# EAGLE design Rs232Iso-due (EAGLE 6.4)
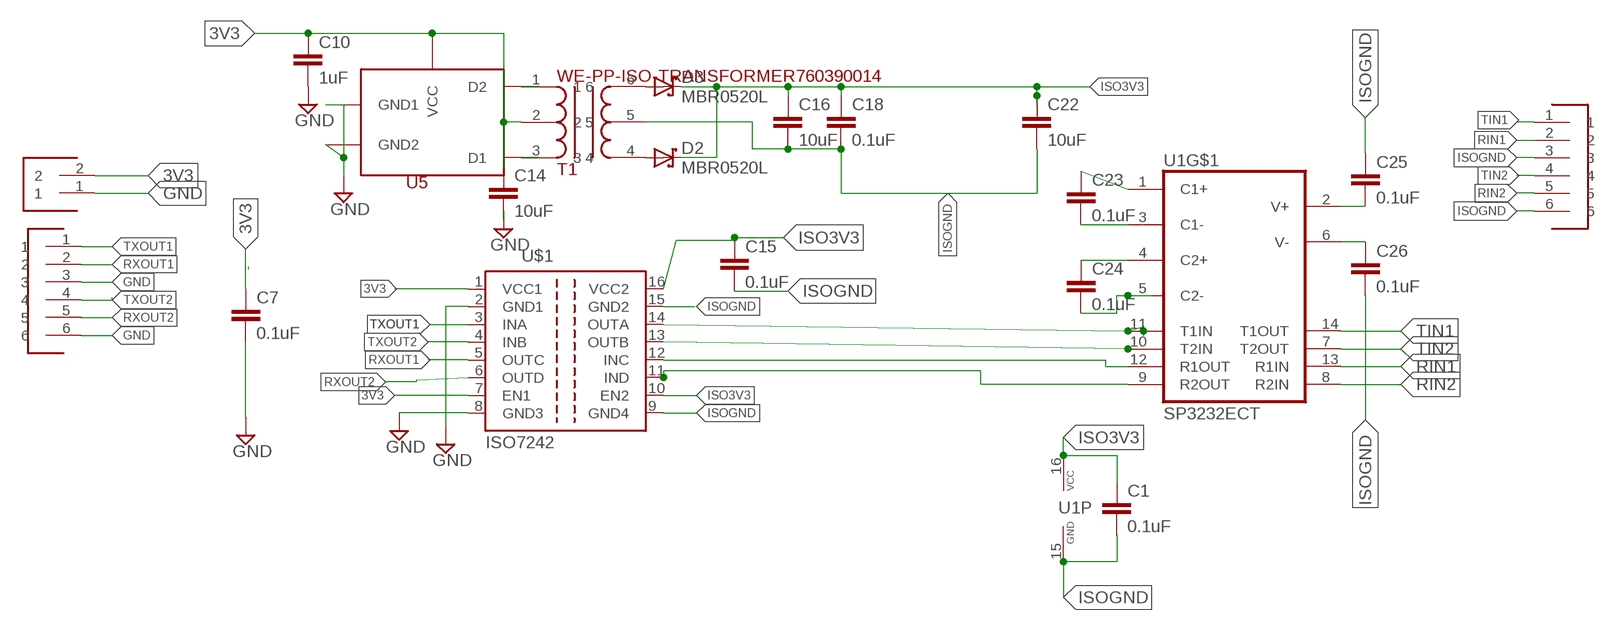
[diagram p0: schematic, sheet 1]

## Parts
C1  0.1uF  CAP0603  [0603]
C7  0.1uF  CAP0603  [0603]
C10  1uF  CAP0805  [0805]
C14  10uF  CAP0805  [0805]
C15  0.1uF  CAP0603  [0603]
C16  10uF  CAP0805  [0805]
C18  0.1uF  CAP0805  [0805]
C22  10uF  CAP0805  [0805]
C23  0.1uF  CAP0603  [0603]
C24  0.1uF  CAP0603  [0603]
C25  0.1uF  CAP0603  [0603]
C26  0.1uF  CAP0603  [0603]
D2  MBR0520L  [SOD123]
D3  MBR0520L  [SOD123]
J1  CON-2STD-2.54  [CON-2]
J2  CON-6  [CON-6]
J4  CON-6  [CON-6]
T1  WE-PP-ISO-TRANSFORMER760390014  [WE_TRANSFORMER]
U1  SP3232ECT  [SO16]
U5  SN6501DBVT  [SOT23-5L]
U$1  ISO7242  [SO-G16]

## Nets
3V3: C7.1 C10.1 C14.1 J1.2 T1.2 U5.2(VCC) U$1.1(VCC1) U$1.7(EN1)
GND: C7.2 C10.2 C14.2 J1.1 J4.3 J4.6 U5.4(GND1) U5.5(GND2) U$1.2(GND1) U$1.8(GND3)
ISO3V3: C1.1 C15.1 C16.1 C18.1 C22.1 D2.C D3.C U1.16(P:VCC) U$1.10(EN2) U$1.16(VCC2)
ISOGND: C1.2 C15.2 C16.2 C18.2 C22.2 C25.1 C26.2 J2.3 J2.6 T1.5 U1.15(P:GND) U$1.9(GND4) U$1.15(GND2)
N$1: D3.A T1.6
N$2: D2.A T1.4
N$4: T1.1 U5.3(D2)
N$5: T1.3 U5.1(D1)
N$6: U1.12(R1OUT) U$1.12(INC)
N$7: U1.10(T2IN) U$1.13(OUTB)
N$9: U1.11(T1IN) U$1.14(OUTA)
N$10: C23.2 U1.3(C1-)
N$11: U1.9(R2OUT) U$1.11(IND)
N$14: C24.1 U1.4(C2+)
N$18: C24.2 U1.5(C2-)
N$19: C23.1 U1.1(C1+)
RIN1: J2.2 U1.13(R1IN)
RIN2: J2.5 U1.8(R2IN)
RXOUT1: J4.2 U$1.5(OUTC)
RXOUT2: J4.5 U$1.6(OUTD)
TIN1: J2.1 U1.14(T1OUT)
TIN2: J2.4 U1.7(T2OUT)
TXOUT1: J4.1 U$1.3(INA)
TXOUT2: J4.4 U$1.4(INB)
V+: C25.2 U1.2(V+)
V-: C26.1 U1.6(V-)

## Library data of the parts
C1 C7 C10 C14-C16 C18 C22-C26 = __bo_caps:CAP
D2 D3 = __my:MBR0520L
J1 = __my:CON-2
J2 J4 = __my:CON-6
T1 = __my:WE-PP-ISO-TRANSFORMER
U1 = __my:SP3232
U5 = __my:SN6501DBVT
U$1 = __my:ISO7242

## Board
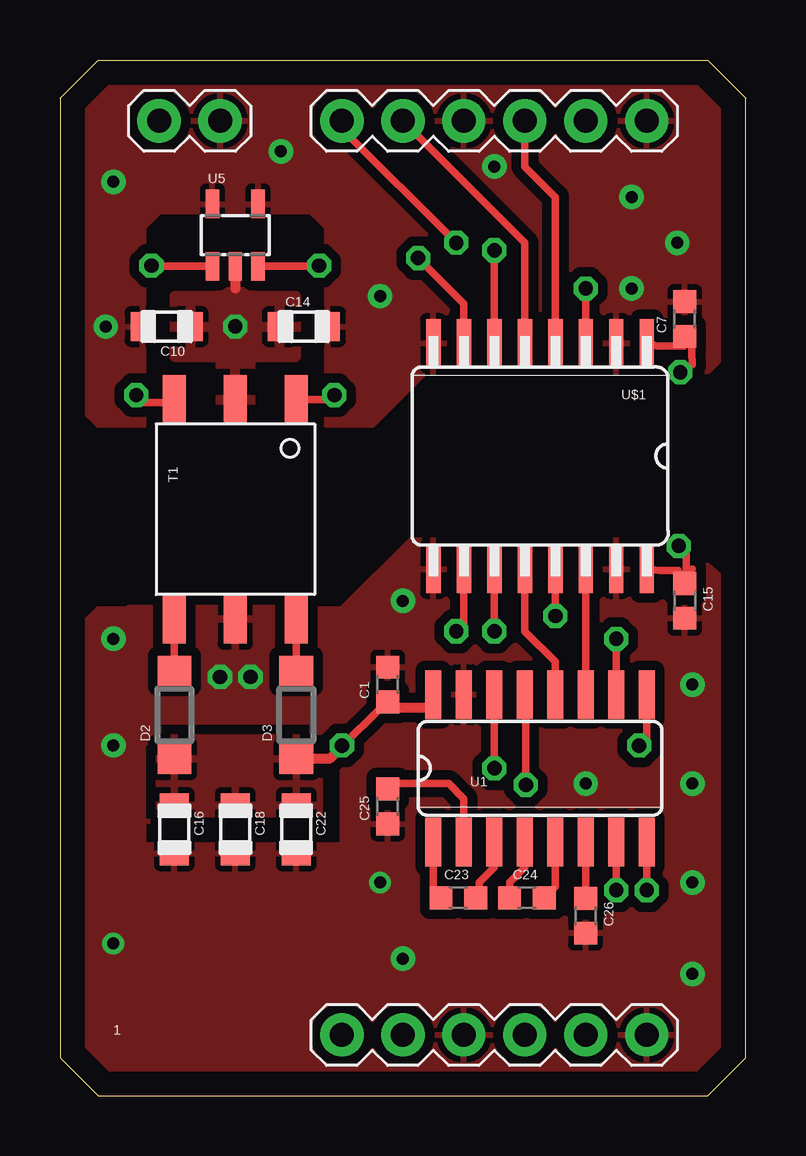
[diagram p1: board, top side]
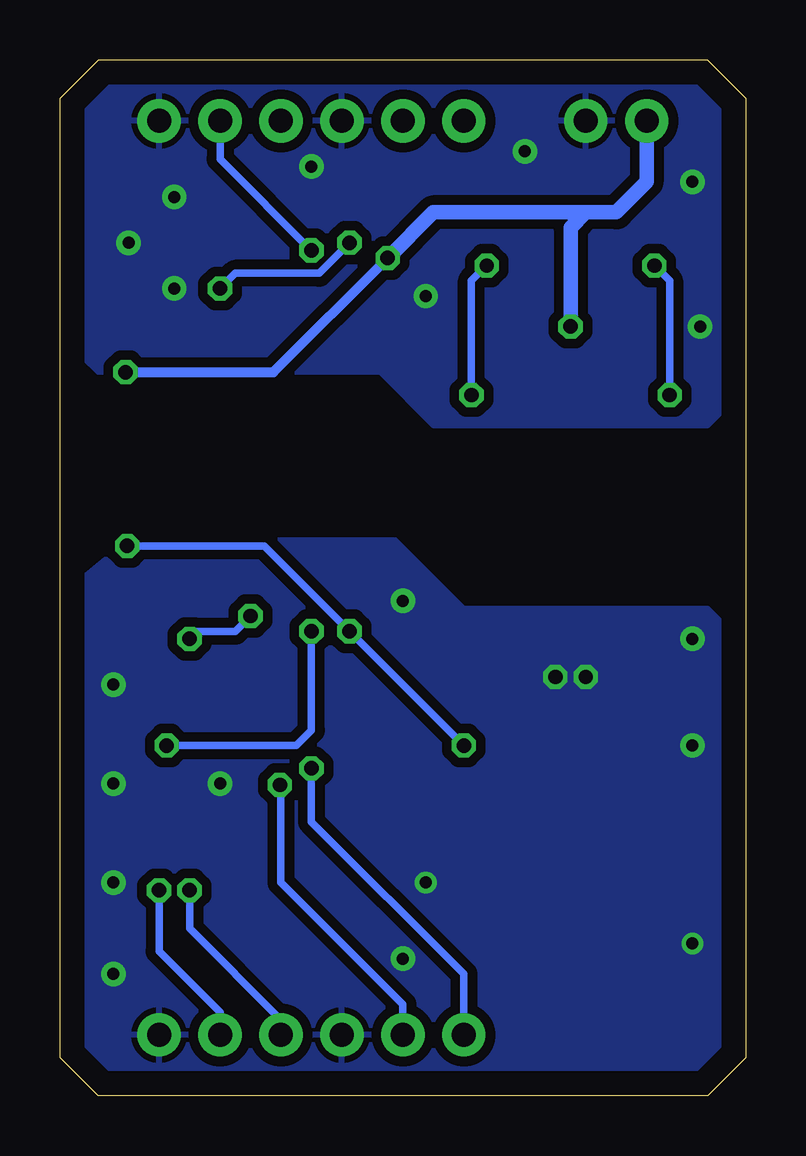
[diagram p2: board, bottom side, seen from below]

Size 28.57 x 43.18 mm. Coordinates in mm from the lower left corner, seen from the top.
Outline: 28.57,1.59 28.57,41.59 26.99,43.18 1.59,43.18 0,41.59 0,1.59 1.59,0 26.99,0 28.57,1.59
Copper layers (1*16): Top 0.035mm / dielectric 1.5mm / Bottom 0.035mm
Design rules "default *": minimum track width 10mil, minimum drill 22mil, track to track 8mil, track to pad 8mil, pad to pad 8mil, via to via 8mil, smd to smd 8mil, copper to edge 40mil, drill to drill 8mil, minimum pad ring 10mil, minimum via ring 8mil, stop-mask expansion 4mil, vias tented up to drill 20mil, thermal gap 10mil

### Footprints (pad centres in the part's own frame; a part is rotated, then mirrored left to right if it is on the bottom)
0603 = smd 0.95 x 0.95: 1 -0.725,0; 2 0.725,0
0805 = smd 1 x 1.2: 1 -1,0; 2 1,0
SOD123 = smd 1.27 x 1.4: A 1.829,0; C -1.829,0
CON-2 = drill 1 pad 1.8: 1 0,1.27; 2 0,-1.27
CON-6 = drill 1 pad 1.8: 1 0,6.35; 2 0,3.81; 3 0,1.27; 4 0,-1.27; 5 0,-3.81; 6 0,-6.35
WE_TRANSFORMER = smd 2.057 x 0.965: 1 -4.572,2.54; 2 -4.572,0; 3 -4.572,-2.54; 4 4.572,-2.54; 5 4.572,0; 6 4.572,2.54
SO16 = smd 0.66 x 2.032: 1 -4.445,-3.073; 2 -3.175,-3.073; 3 -1.905,-3.073; 4 -0.635,-3.073; 5 0.635,-3.073; 6 1.905,-3.073; 7 3.175,-3.073; 8 4.445,-3.073; 9 4.445,3.073; 10 3.175,3.073; 11 1.905,3.073; 12 0.635,3.073; 13 -0.635,3.073; 14 -1.905,3.073; 15 -3.175,3.073; 16 -4.445,3.073
SOT23-5L = smd 0.55 x 1.2: 1 -0.95,-1.3; 2 0,-1.3; 3 0.95,-1.3; 4 0.95,1.3; 5 -0.95,1.3
SO-G16 = smd 0.6 x 2: 1 -4.445,-4.7; 2 -3.175,-4.7; 3 -1.905,-4.7; 4 -0.635,-4.7; 5 0.635,-4.7; 6 1.905,-4.7; 7 3.175,-4.7; 8 4.445,-4.7; 9 4.445,4.7; 10 3.175,4.7; 11 1.905,4.7; 12 0.635,4.7; 13 -0.635,4.7; 14 -1.905,4.7; 15 -3.175,4.7; 16 -4.445,4.7

### Placement (x,y rotation side)
C1  13.65,17.14 90 top
C7  26.04,32.38 90 top
C10  4.45,32.07 180 top
C14  10.16,32.07 0 top
C15  26.04,20.64 270 top
C16  4.76,11.11 270 top
C18  7.3,11.11 270 top
C22  9.84,11.11 270 top
C23  16.6,8.26 0 top
C24  19.46,8.26 0 top
C25  13.65,12.06 90 top
C26  21.9,7.51 270 top
D2  4.76,15.88 90 top
D3  9.84,15.88 90 top
J1  5.4,40.64 270 top
J2  18.1,2.54 90 top
J4  18.1,40.64 90 top
T1  7.3,24.45 270 top
U1  20,13.65 0 top
U5  7.3,35.88 0 top
U$1  20,26.67 180 top

### Tracks (layer width: path | path; a pad name or v marks a point on that pad's centre or on a via)
3V3  (via drill 0.6)
  Top 0.305: U$1.1 24.89,31.25 25.98,31.25 C7.1 26.3,31.49 26.35,30.48 v25.85,30.16 | U$1.7 16.83,33.02 v14.92,34.92
  Top 0.406: U5.2 7.3,33.66
  Bottom 0.406: 7.3,36.71 7.18,36.71 | v25.85,30.16 19.69,30.16 v14.92,34.92
  Bottom 0.61: v14.92,34.92 13.02,36.83 7.06,36.83 | J1.2 4.13,38.1 5.4,36.83 6.67,36.83 | 6.67,36.83 7.3,36.2 v7.3,32.07 | 6.67,36.83 7.06,36.83 | 7.06,36.83 7.18,36.71
  pour Top (isolate 0.406): 4.76,33.34 4.76,30.8 6.67,30.8 6.67,28.57 7.94,28.57 7.94,30.8 9.84,30.8 9.84,33.34 7.94,33.34 7.94,34.92 6.67,34.92 6.67,33.34
GND  (via drill 0.5 pad 1.02)
  other vias: 13.33,33.34 25.72,35.56 18.1,38.73 23.81,37.47 23.81,33.66 2.22,38.1 1.91,32.07 9.21,39.37
  pour Bottom (isolate 0.406): 0.95,41.27 2.54,42.86 26.04,42.86 27.62,41.27 27.62,30.8 26.99,30.16 15.24,30.16 13.02,27.94 1.59,27.94 0.95,28.57
  pour Top (isolate 0.406): 0.95,41.27 2.54,42.86 26.04,42.86 27.62,41.27 27.62,30.8 26.99,30.16 15.24,30.16 13.02,27.94 11.11,27.94 11.11,36.2 10.48,36.83 4.13,36.83 3.49,36.2 3.49,27.94 1.59,27.94 0.95,28.57
ISO3V3  (via drill 0.6)
  Top 0.305: 13.38,16.19 11.75,14.56 v11.75,14.61 | v16.51,19.37 16.83,19.68 U$1.10 | U$1.16 25.02,21.91 25.76,21.91 C15.1 | C15.1 26.35,21.97 | C15.1 26.1,21.7 26.1,22.61 v25.78,22.92
  Top 0.406: U1.16 15.66,16.19 13.38,16.19 C1.1 | 11.75,14.56 11.24,14.05 D3.C
  Bottom 0.305: 12.07,14.92 v11.75,14.61 v16.51,19.37 20.07,22.92 v25.78,22.92
  pour Top (isolate 0.406): 4.13,14.92 10.79,14.92 10.79,11.75 4.13,11.75
ISOGND  (via drill 0.5, 0.5 pad 1.02, 0.6)
  other vias: 26.35,17.14 6.67,17.46 26.35,8.89 2.22,19.05 2.22,6.35 26.35,13.02 26.35,5.08 21.91,13.02 14.29,5.71 2.22,14.61 14.29,20.64 7.94,17.46 13.33,8.89
  pour Bottom (isolate 0.406): 0.95,19.68 1.59,20.32 11.75,20.32 14.6,23.18 25.72,23.18 27.62,21.59 27.62,1.91 26.35,0.64 2.22,0.64 0.95,1.91
  pour Top (isolate 0.406): 11.75,20.32 11.75,0.64 26.35,0.64 27.62,1.91 27.62,21.59 25.72,23.18 14.6,23.18
  pour Top (isolate 0.406, rank 2): 0.95,19.68 1.59,20.32 11.75,20.32 11.75,11.43 3.49,11.43 3.49,0.64 2.22,0.64 0.95,1.91
  pour Top (isolate 0.406, rank 2): 2.86,20.32 10.48,20.32 10.48,15.56 2.86,15.56
  pour Top (isolate 0.406): 3.18,10.48 12.38,10.48 12.38,0.64 3.18,0.64
N$1
  Top 0.305: T1.6 D3.A
N$2
  Top 0.305: T1.4 D2.A
N$4  (via drill 0.6)
  Top 0.305: T1.1 11.24,29.02 v11.43,29.21 | U5.3 10.76,34.58 v10.8,34.61
  Bottom 0.305: v11.43,29.21 11.43,33.97 v10.8,34.61
N$5  (via drill 0.6)
  Top 0.305: U5.1 3.84,34.58 v3.81,34.61 | v3.18,29.21 3.49,28.89 4.64,28.89 T1.3
  Bottom 0.305: v3.81,34.61 3.18,33.97 v3.18,29.21
N$6
  Top 0.305: U$1.12 19.37,19.37 20.64,18.1 U1.12
N$7  (via drill 0.6)
  Top 0.305: U$1.13 v20.64,20 | v23.18,19.05 U1.10
  Bottom 0.305: v20.64,20 21.27,19.37 22.86,19.37 v23.18,19.05
N$9
  Top 0.305: U$1.14 U1.11
N$10
  Top 0.305: U1.3 18.1,9.53 17.46,8.89 17.46,8.39 C23.2
N$11  (via drill 0.6)
  Top 0.305: U$1.11 v18.1,19.37 | U1.9 24.45,14.92 v24.13,14.61
  Bottom 0.305: v24.13,14.61 18.73,14.61 18.1,15.24 v18.1,19.37
N$14
  Top 0.305: U1.4 19.37,9.53 18.73,8.89 C24.1
N$18
  Top 0.305: U1.5 20.64,8.71 C24.2
N$19
  Top 0.305: U1.1 15.56,8.57 C23.1
RIN1  (via drill 0.6)
  Top 0.305: v19.41,12.96 19.41,16.68 U1.13
  Bottom 0.305: v19.41,12.96 19.37,12.91 19.37,8.89 14.29,3.81 J2.2
RIN2  (via drill 0.6)
  Top 0.305: U1.8 v24.45,8.57
  Bottom 0.305: v24.45,8.57 24.45,6.03 21.91,3.49 J2.5
RXOUT1
  Top 0.305: U$1.5 19.37,35.56 J4.2
RXOUT2  (via drill 0.6)
  Top 0.305: v18.1,35.24 U$1.6
  Bottom 0.305: J4.5 21.91,39.05 v18.1,35.24
TIN1  (via drill 0.6)
  Top 0.305: U1.14 v18.1,13.65
  Bottom 0.305: v18.1,13.65 18.1,11.43 11.75,5.08 J2.1
TIN2  (via drill 0.6)
  Top 0.305: U1.7 v23.18,8.57
  Bottom 0.305: v23.18,8.57 23.18,6.99 19.37,3.17 J2.4
TXOUT1  (via drill 0.6)
  Top 0.305: v21.91,33.66 U$1.3 | v16.51,35.56 11.75,40.32 J4.1
  Bottom 0.305: v21.91,33.66 21.27,34.29 17.78,34.29 v16.51,35.56
TXOUT2
  Top 0.305: J4.4 19.37,38.73 20.64,37.47 U$1.4
V+
  Top 0.305: 13.69,13.02 16.19,13.02 16.83,12.38 U1.2
  Top 0.406: C25.2 13.69,13.02
V-
  Top 0.305: U1.6 21.91,8.24 C26.1

### Text on the board
tPlace: 1